# EAGLE design Domino Single USB No Teardrop (EAGLE 6.5.0)
DATABASE: ./../Common/BOM/Domino_DB.txt; DRAWN: M.STEMPIN; REV: E
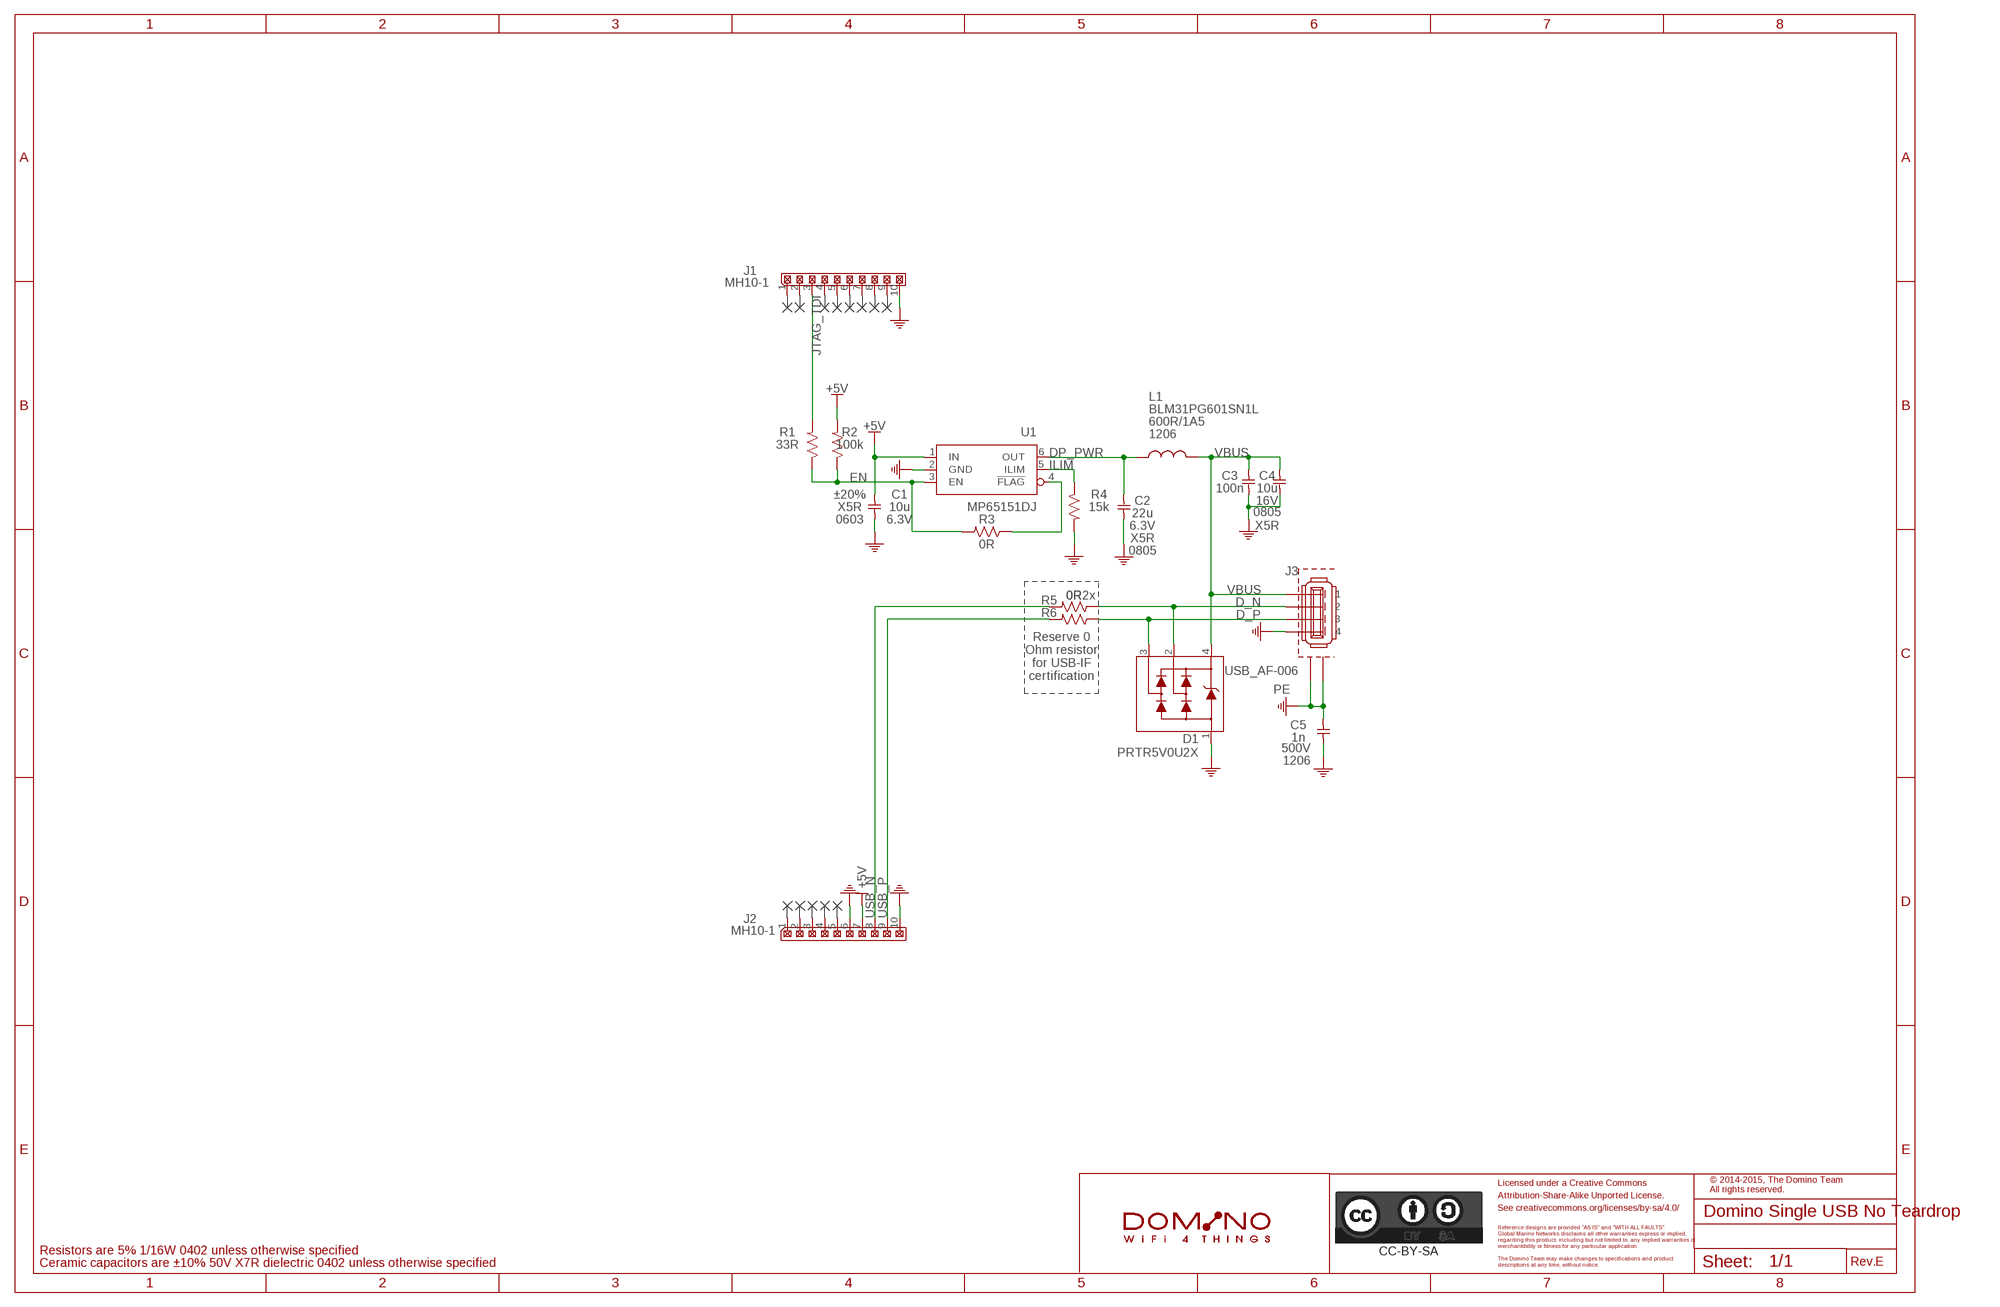
[diagram p0: schematic, sheet 1]
PORT1 (NC): BOM: EXCLUDE
PORT2 (NC): BOM: EXCLUDE
PORT3 (NC): BOM: EXCLUDE
PORT5 (NC): BOM: EXCLUDE
PORT6 (NC): BOM: EXCLUDE
PORT7 (NC): BOM: EXCLUDE
PORT8 (NC): BOM: EXCLUDE
PORT9 (NC): BOM: EXCLUDE
PORT10 (NC): BOM: EXCLUDE
PORT11 (NC): BOM: EXCLUDE
PORT12 (NC): BOM: EXCLUDE
PORT13 (NC): BOM: EXCLUDE
PORT14 (NC): BOM: EXCLUDE

## Parts
C1  10u  CAP_0603  [C0603]
C2  22u  CAP_0805  [C0805]
C3  100n  CAP_0402  [C0402]
C4  10u  CAP_0805  [C0805]
C5  1n  CAP_1206  [C1206]
CC-BY-SA1  CC-BY-SA_LOGO  [CC-BY-SA_LOGO]
D1  PRTR5V0U2X  [SOT143B]
J1  MH10-1  [MH10-1-0.1]
J2  MH10-1  [MH10-1-0.1]
J3  USB_AF-006  [USB_AF-006]
L1  BLM31PG601SN1L  FB_1206  [FB1206]
R1  33R  RES_0402  [R0402]
R2  100k  RES_0402  [R0402]
R3  0R  RES_0402  [R0402]
R4  15k  RES_0402  [R0402]
R5  0R  RES_0402  [R0402]
R6  0R  RES_0402  [R0402]
S1  DOMINO_LOGO  [DOMINO_LOGO]
U1  MP65151DJ  [SOT23-6]

## Nets
+5V: C1.1 J2.7 R2.2 U1.1(IN)
D_N [USB]: D1.2 J3.2 R5.1
D_P [USB]: D1.3 J3.3 R6.1
DP_PWR: C2.1 L1.1 U1.6(OUT)
EN: R1.1 R2.1 R3.2 U1.3(EN)
GND: C1.2 C2.2 C3.2 C4.2 C5.2 D1.1 J1.10 J2.6 J2.10 J3.4 R4.2 U1.2(GND)
ILIM: R4.1 U1.5(ILIM)
JTAG_TDI: J1.3 R1.2
N$1: R3.1 U1.4(!FLAG)
PE: C5.1 J3.S$1(G) J3.S$2(G)
USB_N [USB]: J2.8 R5.2
USB_P [USB]: J2.9 R6.2
VBUS: C3.1 C4.1 D1.4 J3.1 L1.2
Unconnected: J1.1 J1.2 J1.4 J1.5 J1.6 J1.7 J1.8 J1.9 J2.1 J2.2 J2.3 J2.4 J2.5

## Notes on the sheet
- 2x
- Reserve 0
  Ohm resistor
  for USB-IF
  certification
- Licensed under a Creative Commons
- © 2014-2015, The Domino Team
  All rights reserved.
- Attribution-Share-Alike Unported License.
- See creativecommons.org/licenses/by-sa/4.0/
- Reference designs are provided "AS IS" and "WITH ALL FAULTS".
- Global Marine Networks disclaims all other warranties express or implied,
- regarding this product, including but not limited to, any implied warranties of
- merchantibility or fitness for any particular application.
- Resistors are 5% 1/16W 0402 unless otherwise specified
- The Domino Team may make changes to specifications and product
- Ceramic capacitors are ±10% 50V X7R dielectric 0402 unless otherwise specified | descriptions at any time, without notice. | Rev.

## Library data of the parts
C1 = Domino:CAP_: Capacitor; PARTNO: C0603_10u_X5R_20%_CER_6V3; SIZE: 0603; TC: X5R; TOL: ±20%; TYPE: CER; VOLT: 6.3V
C2 = Domino:CAP_: Capacitor; PARTNO: C0805_22u_X5R_20%_CER_6V3; SIZE: 0805; TC: X5R; TOL: ±20%; TYPE: CER; VOLT: 6.3V
C3 = Domino:CAP_: Capacitor; PARTNO: C0402_100n_X7R_10%_CER_50V; SIZE: 0402; TC: X7R; TOL: ±10%; TYPE: CER; VOLT: 50V
C4 = Domino:CAP_: Capacitor; PARTNO: C0805_10u_X5R_10%_CER_16V; SIZE: 0805; TC: X5R; TOL: ±10%; TYPE: CER; VOLT: 16V
C5 = Domino:CAP_: Capacitor; PARTNO: C1206_1n_X7R_10%_CER_500V; SIZE: 1206; TC: X7R; TOL: ±10%; TYPE: CER; VOLT: 500V
CC-BY-SA1 = Domino:CC-BY-SA_LOGO: Attribution-Share-Alike Unported License See creativecommons.org/licenses/by-sa/3.0/ for details.; BOM: EXCLUDE
D1 = Domino:PRTR5V0U2X: Ultra low capacitance double rail-to-rail ESD protection diode; PARTNO: PRTR5V0U2X; RATE: 300W; VOLT: 5V
J1 J2 = Domino:MH10-1: 10x1 Pin Male Header; PARTNO: MH10-1-0.1
J3 = Domino:USB_AF-006: USB-A Right/Angle SMT Connector; PARTNO: USB_AF-006
L1 = Domino:FB_: Ferrite Bead; OPT: 600R/1A5; PARTNO: BLM31PG601SN1L; SIZE: 1206
R1 = Domino:RES_: Resistor; PARTNO: R0402_33R_5%_62.5mW; RATE: 62.5mW; SIZE: 0402; TOL: 5%
R2 = Domino:RES_: Resistor; PARTNO: R0402_100k_5%_62.5mW; RATE: 62.5mW; SIZE: 0402; TOL: 5%
R3 R5 R6 = Domino:RES_: Resistor; PARTNO: R0402_0R_5%_62.5mW; RATE: 62.5mW; SIZE: 0402; TOL: 5%
R4 = Domino:RES_: Resistor; PARTNO: R0402_15k_5%_62.5mW; RATE: 62.5mW; SIZE: 0402; TOL: 5%
S1 = Domino:DOMINO_LOGO: Domino Logo; BOM: EXCLUDE
U1 = Domino:MP65151DJ: Precision 60mA-1.7A Programmable Current-Limited Power Distribution Switch; PARTNO: MP65151DJ

## Net classes
1 USB: width 0.368 mm, clearance 0.152 mm to class 0, clearance 0.152 mm
2 PoE: width 0.457 mm, clearance 0.254 mm to class 0, clearance 0.254 mm to class 1, clearance 0.254 mm

## Board
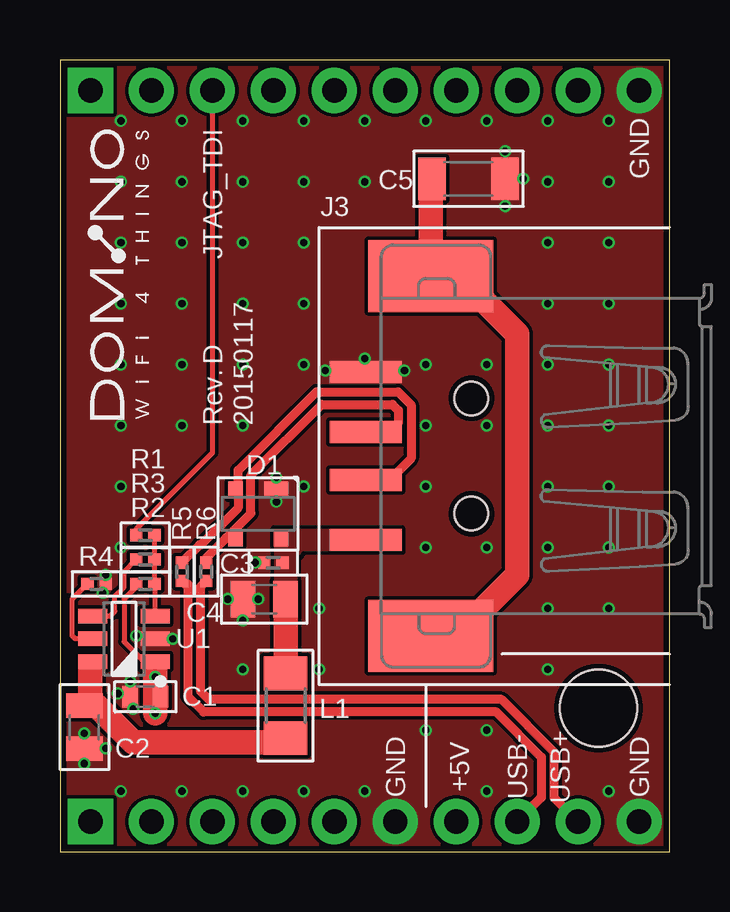
[diagram p1: board, top side]
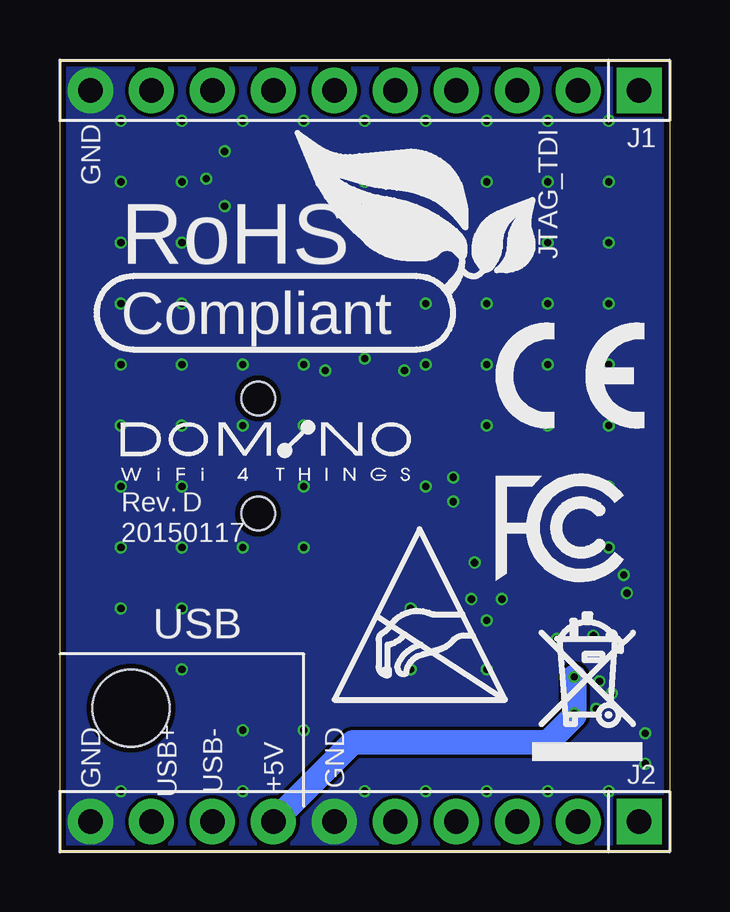
[diagram p2: board, bottom side, seen from below]

Size 25.4 x 33.02 mm. Coordinates in mm from the lower left corner, seen from the top.
Outline: 0,0 25.4,0 25.4,33.02 0,33.02 0,0
Copper layers (1*16): Top 0.043mm / dielectric 1mm / Bottom 0.043mm
Design rules "Domino": minimum track width 0.1mm, minimum drill 0.3mm, track to track 6mil, track to pad 6mil, pad to pad 6mil, via to via 6mil, smd to smd 0mil, copper to edge 0.25mm, drill to drill 0.35mm, minimum pad ring 0.085mm, minimum via ring 0.1mm, stop-mask expansion 0mil, vias tented up to drill 0.45mm, thermal gap 0.2mm
Holes 3.2 mm at 22.44,6

### Footprints (pad centres in the part's own frame; a part is rotated, then mirrored left to right if it is on the bottom)
C0603 = smd 0.635 x 0.889: 1 -0.635,0; 2 0.635,0
C0805 = smd 1.016 x 1.524: 1 -0.889,0; 2 0.889,0
C0402 = smd 0.508 x 0.508: 1 -0.381,0; 2 0.381,0
C1206 = smd 1.143 x 1.778: 1 -1.524,0; 2 1.524,0
SOT143B = smd 1 x 0.7: 1 -0.75,-1 | smd 0.6 x 0.7: 2 0.95,-1; 3 0.95,1; 4 -0.95,1
MH10-1-0.1 = drill 1.016 pad 1.88 square: 1 0,0 | drill 1.016 pad 1.88: 2 2.54,0; 3 5.08,0; 4 7.62,0; 5 10.16,0; 6 12.7,0; 7 15.24,0; 8 17.78,0; 9 20.32,0; 10 22.86,0
USB_AF-006 = smd 0.9 x 3: 1 -3.5,4.4; 2 -1,4.4; 3 1,4.4; 4 3.5,4.4 | smd 3 x 5.2: S$1 -7.5,1.7; S$2 7.5,1.7 | hole 1.4: -2.4,0; 2.4,0
FB1206 = smd 1.4 x 1.8: 1 -1.35,0; 2 1.35,0
R0402 = smd 0.508 x 0.508: 1 -0.381,0; 2 0.381,0
SOT23-6 = smd 0.6 x 1.2: 1 -0.95,-1.3; 2 0,-1.3; 3 0.95,-1.3; 4 0.95,1.3; 5 0,1.3; 6 -0.95,1.3

### Placement (x,y rotation side)
C1  3.56,6.48 180 top
C2  1.02,5.21 270 top
C3  8.89,12.06 180 top
C4  8.51,10.54 180 top
C5  17.02,28.07 0 top
CC-BY-SA1  -5.08,-50.8 0 top  (outside the outline)
D1  8.26,14.1 180 top
DRILEGEND  [DRILEGEND]  81.53,59.94 0 top  (outside the outline)
J1  1.27,31.75 180 bottom
J2  1.27,1.27 180 bottom
J3  17.14,16.51 90 top
L1  9.4,6.1 90 top
R1  3.56,13.21 180 top
R2  3.56,11.18 180 top
R3  3.56,12.19 0 top
R4  1.52,11.18 0 top
R5  5.08,11.68 270 top
R6  6.1,11.68 270 top
S1  -45.72,-48.26 0 top  (outside the outline)
U1  2.67,8.89 90 top
U$1  [ROHS_LOGO]  22.86,21.59 0 bottom
U$3  [A5L-LOC]  -55.88,-62.23 0 top  (outside the outline)
U$4  [DOMINO_LOGO_SMALL]  22.86,16.51 0 bottom
U$5  [CE_LOGO_SMALL]  7.24,17.65 0 bottom
U$6  [FCC_LOGO_SMALL]  7.24,11.3 0 bottom
U$8  [RECYCLE_BIN_LOGO]  5.71,3.81 0 bottom
U$10  [DOMINO_LOGO_SMALL]  2.67,18.03 90 top
U$11  [ESD_LOGO]  13.97,6.35 0 bottom

### Tracks (layer width: path | path; a pad name or v marks a point on that pad's centre or on a via)
+5V  (via drill 0.3)
  Top 0.203: U1.1 3.49,7.94 2.67,8.76 2.67,10.54 3.17,11.05 R2.2
  Top 0.508: C1.1 3.97,6.48 | 3.94,7.62 3.94,7.91 U1.1
  Top 0.762: 3.97,7.59 3.94,7.62
  Top 1.016: v3.97,5.78 3.97,6.48 v3.97,7.3 3.97,7.59
  Bottom 1.016: v3.97,7.3 3.97,5.68 5.08,4.57 13.21,4.57 J2.7
D_N
  Top 0.368: J3.2 13.73,15.51 14.63,16.41 14.63,18.64 14.09,19.18 10.69,19.18 7.42,15.91 7.42,15.16 7.3,15.05 | D1.2 7.3,15.05 | 7.3,15.05 7.3,14.92 7.42,14.81 7.42,14.35 5.87,12.8 5.82,12.8 R5.1
D_P
  Top 0.368: J3.3 13.7,17.51 14.1,17.91 14.1,18.41 13.85,18.66 10.9,18.66 7.95,15.71 7.95,14.12 6.92,13.1 | D1.3 6.92,13.1 | 6.92,13.1 6.1,12.27 R6.1
DP_PWR
  Top 0.508: 1.27,7.62 1.27,7.84 U1.6
  Top 1.016: L1.1 9.22,4.57 3.05,4.57 1.52,6.1 C2.1 1.27,6.35 1.27,7.62
EN
  Top 0.203: R1.1 R3.2 R2.1 3.97,11.15 U1.3
GND  (via drill 0.3)
  other vias: 2.54,30.48 5.08,30.48 7.62,30.48 10.16,30.48 12.7,30.48 15.24,30.48 17.78,30.48 20.32,30.48 22.86,30.48 22.86,27.94 20.32,27.94 12.7,27.94 20.32,25.4 22.86,25.4 22.86,22.86 20.32,22.86 7.62,20.32 10.16,20.32 17.78,20.32 20.32,20.32 22.86,20.32 22.86,17.78 20.32,17.78 17.78,17.78 20.32,15.24 22.86,15.24 22.86,12.7 20.32,12.7 17.78,12.7 20.32,10.16 22.86,10.16 20.32,7.62 10.79,7.62 15.24,5.08 17.78,5.08 22.86,2.54 17.78,2.54 19.3,28.07 18.54,29.21 18.54,26.92 12.7,20.57 14.35,20.07 11.05,20.07 8.13,12.06 6.99,10.54 7.62,9.65 8.26,10.54 15.24,17.78 15.24,15.24 15.24,20.32 15.24,12.7 7.62,17.78 10.16,15.24 9.02,14.61 9.02,15.62 10.16,27.94 7.62,27.94 5.08,27.94 2.54,27.94 2.54,25.4 5.08,25.4 7.62,25.4 10.16,25.4 10.16,22.86 7.62,22.86 5.08,22.86 2.54,22.86 2.54,20.32 5.08,20.32 2.54,17.78 2.54,2.54 5.08,2.54 7.62,2.54 10.16,2.54 12.7,2.54 1.02,3.68 2.92,7.11 2.41,6.6 1.78,10.79 1.91,11.56 3.17,9.02 4.7,8.89 5.08,17.78 2.54,15.24 2.54,12.7 7.62,7.62 10.79,10.16 1.02,4.95 1.91,4.32 3.05,5.97
  pour Bottom (no thermals): 0,33.02 25.4,33.02 25.4,0 0,0
  pour Top (rank 2, no thermals): 0,33.02 25.4,33.02 25.4,0 0,0
ILIM
  Top 0.203: U1.5 0.64,8.89 0.51,9.02 0.51,10.54 R4.1
JTAG_TDI
  Top 0.203: J1.3 6.35,16.64 3.17,13.46 R1.2
N$1
  Top 0.203: U1.4 2.09,9.84 2.29,10.03 2.29,10.67 2.67,11.05 2.67,11.68 R3.1
PE
  Top 1.016: C5.1 15.45,28.07 J3.S$2 15.45,23.88 16.76,23.88 19.05,21.59 19.05,11.56 16.5,9.01 J3.S$1
USB_N
  Top 0.368: J2.8 20.06,2.28 20.06,3.96 18.18,5.84 5.99,5.84 5.33,6.5 5.33,11.05 | R5.2 5.33,11.05 | 5.33,11.05 5.33,11.18
USB_P
  Top 0.368: J2.9 20.58,2.28 20.58,4.17 18.4,6.36 6.2,6.36 5.85,6.71 5.85,11.05 R6.2
VBUS
  Top 1.016: C4.1 L1.2
  pour Top (no thermals): 14.15,13.36 9.02,13.36 9.02,9.91 9.8,9.91 9.8,12.34 10.08,12.65 14.15,12.65

### Text on the board
tPlace: GND | JTAG_TDI | GND | +5V | USB- | USB+ | GND
bPlace: GND | JTAG_TDI | USB | GND | +5V | USB- | USB+ | GND
tNames: Rev.
bNames: Rev.
Document: DRILL CHART: TOP TO BOTTOM | LINE WIDTH IMPEDANCE CHART FOR REFERENCE | Class | USB | Type | Diff Coated Coplanar Waveguide With Ground 1B | Layer | Impedance | Trace Width | Trace Separation | Ground Separation | TOP, / BOTTOM | 90 Ohms | 14.5 mils | 6 mils | 6 mils | STACK-UP FOR REFERENCE | LAYER 1 L1 TOP | 18 UM CU + 12.5 UM PLATING (30.5 UM) | 1.061 MM+/-10% | CORE | 1.0 MM CORE FR-4 LG 135 / INCLUDING COPPER | LAYER 4 L16 BOTTOM | 18 UM CU + 12.5 UM PLATING (30.5 UM) | NOTES: | 1. PRINTED CIRCUIT BOARD MADE FROM NEMA GRADE FR-4 TG 135 EPOXY / LAMINATE WITH 18 UM COPPER PLATING AND 1 MM THICKNESS. | 2. ALL DIMENSIONS ARE GIVEN IN MILLIMETERS EXCEPT TRACE WIDTH/SPACE. | 3. CIRCUIT PATHS ARE FOR REFERENCE ONLY. | 4. HOLE SIZES SHOWN ARE FINISHED DIAMETERS AFTER PLATING. | 5. BOARD PLATED USING REFLOW OR SIMILAR METHOD. | 6. BOARD TO HAVE WHITE SOLDER MASK ON PLATED SURFACES USING WET / FILM SR100 OR SR1010 EPOXY. / EQUIVALENT WET OR DRY FILM MAY BE USED. | 7. SILKSCREEN BOARD USING BLACK INK. DISTORTION OF SILKSCREEN / IS ACCEPTABLE OVER TRACES. EPOXY INK ON PLATED LANDS IS NOT / ACCEPTABLE | 8. THE FOLLOWING INFORMATION APPLIES TO THIS BOARD: | * 2 COPPER LAYERS | * 1 MM BOARD THICKNESS | * REQUIRES TOP AND BOTTOM SIDE SILKSCREENS | © 2014-2015, The Domino Team. / All rights reserved. | Licensed under a Creative Commons / Attribution-Share-Alike Unported License. / See creativecommons.org/licenses/by-sa/4.0/ | Reference designs are provided "AS IS" and "WITH ALL FAULTS". / The Domino Team disclaims all other warranties express or implied, / regarding this product, including but not limited to, any implied warranties of / merchantibility or fitness for any particular application. | The Domino Team may make changes to specifications and product descriptions / at any time, without notice. | Rev.
DrillLegend: LAYER-STACK
DrillLegend_01-16: 01-16
DrillLegend_01-20: 01-20
Pinout: JTAG_TDI | GND | GND | +5V | USB- | USB+ | GND | Pinout (.PIN)
Component_side: Component Side (.CMP)
Solder_side: Solder side (.SOL)
Silk_screen_CMP: Silk screen CMP (.PLC)
Silk_screen_SOL: Silk screen SOL (.PLS)
Solder_stop_mask_CMP: Solder stop mask CMP (.STC)
Solder_stop_mask_SOL: Solder stop mask SOL (.STS)
Cream_frame_CMP: Cream frame CMP (.CRC)
Cream_frame_SOL: Cream frame SOL (.CRS)
Drill_data: Drill data (.DRD)
Component_Assembly_CMP: Component Assembly CMP (.ASC)
Component_Assembly_SOL: Component Assembly SOL (.ASS)
Outline: Outline (.OLN)